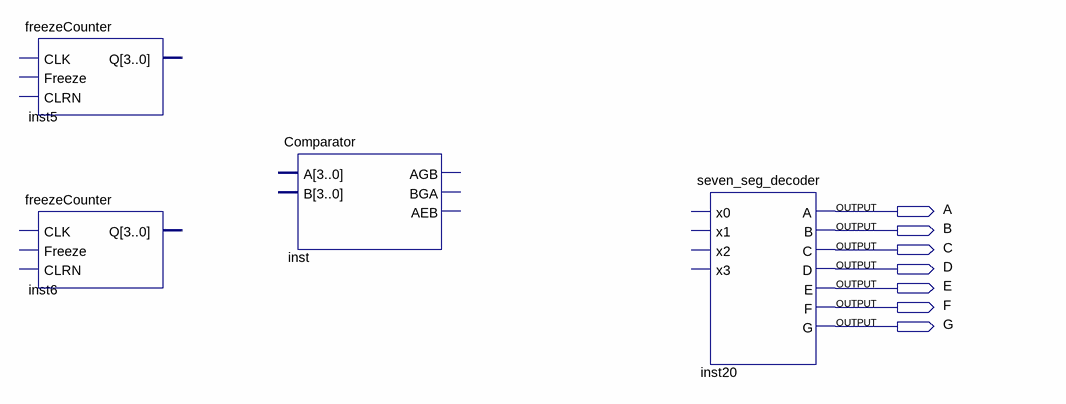
[diagram p0: schematic sheet]
// Quartus schematic FinalProject.bdf as structural Verilog: 4 symbols, 7 pins
module FinalProject (
  output A,
  output B,
  output C,
  output D,
  output E,
  output F,
  output G
);

  freezeCounter inst5 ();  // open: CLK, Freeze, CLRN, Q
  freezeCounter inst6 ();  // open: CLK, Freeze, CLRN, Q
  Comparator inst ();  // open: A, B, AGB, BGA, AEB
  seven_seg_decoder inst20 (.A(A), .B(B), .C(C), .D(D), .E(E), .F(F), .G(G));  // open: x0, x1, x2, x3
endmodule
